# EAGLE design FioSaber Prototype (EAGLE 6.5.0)
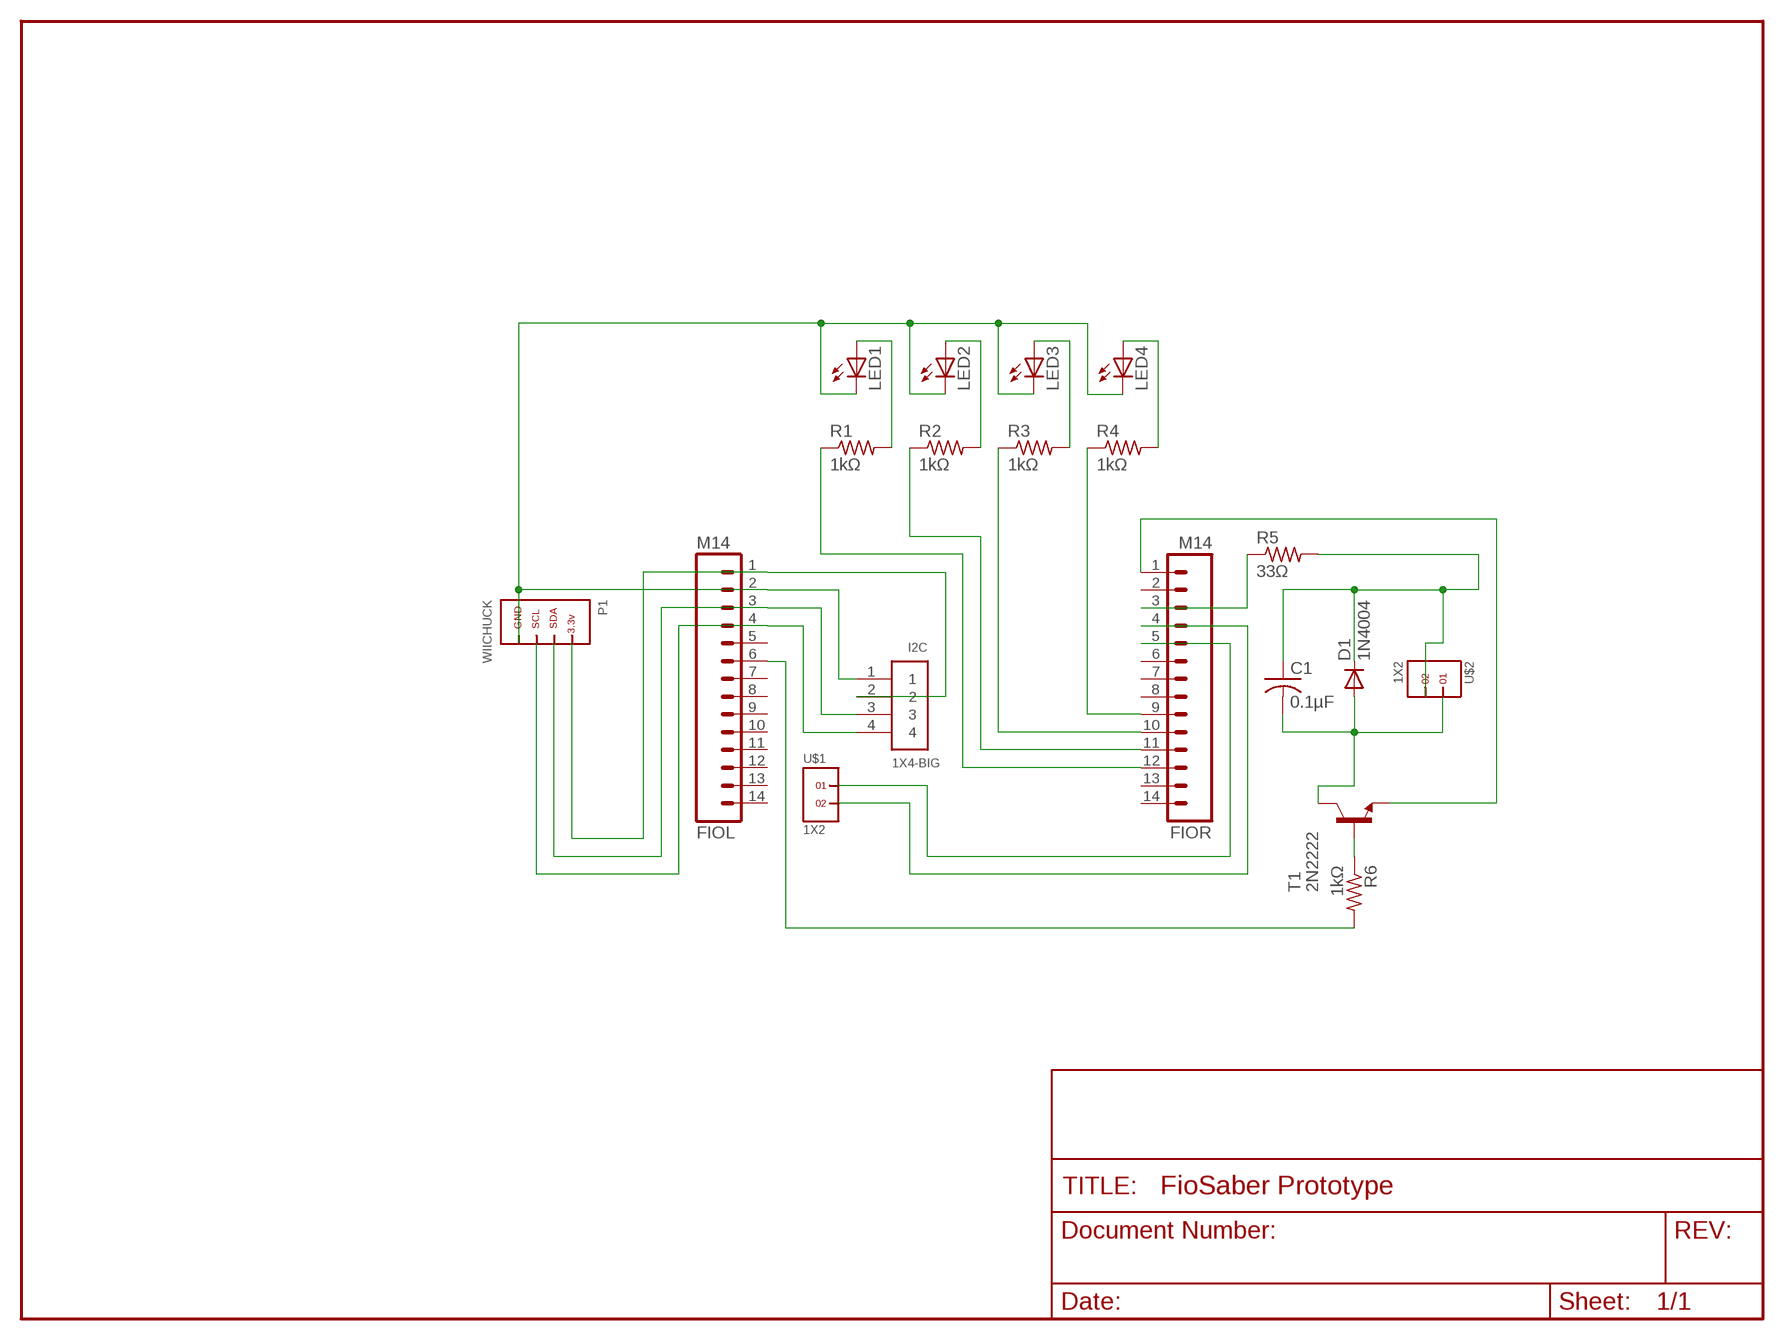
[diagram p0: schematic, sheet 1]

## Parts
C1  0.1µF  C-US025-025X050  [C025-025X050]
D1  1N4004  [DO41-10]
FIOL  M14  [1X14]
FIOR  M14  [1X14]
I2C  1X4-BIG  [1X04-BIG]
LED1  LED3MM  [LED3MM]
LED2  LED3MM  [LED3MM]
LED3  LED3MM  [LED3MM]
LED4  LED3MM  [LED3MM]
P1  WIICHUCK  [MEMOREX_RECEIVER]
R1  1kΩ  R-US_0207/10  [0207/10]
R2  1kΩ  R-US_0207/10  [0207/10]
R3  1kΩ  R-US_0207/10  [0207/10]
R4  1kΩ  R-US_0207/10  [0207/10]
R5  33Ω  R-US_0207/10  [0207/10]
R6  1kΩ  R-US_0207/10  [0207/10]
T1  2N2222  [TO92-EBC-OVAL]
U$1  1X2  [1X2]
U$2  1X2  [1X2]

## Nets
N$1: FIOL.1 I2C.2 P1.PWR
N$2: FIOR.3 R5.1
N$3: FIOL.3 I2C.3 P1.SDA
N$4: FIOL.4 I2C.4 P1.SCL
N$5: FIOR.12 R1.1
N$6: FIOR.11 R2.1
N$7: FIOR.10 R3.1
N$8: FIOR.9 R4.1
N$9: LED1.A R1.2
N$10: LED2.A R2.2
N$11: LED3.A R3.2
N$12: LED4.A R4.2
N$13: FIOL.2 I2C.1 LED1.K(C) LED2.K(C) LED3.K(C) LED4.K(C) P1.GND
N$14: FIOR.4 U$1.2
N$15: FIOR.5 U$1.1
N$16: FIOL.6 R6.2
N$17: FIOR.1 T1.E
N$18: R6.1 T1.B
N$19: C1.2 D1.A T1.C U$2.1
N$20: C1.1 D1.C R5.2 U$2.2
Unconnected: FIOL.5 FIOL.7 FIOL.8 FIOL.9 FIOL.10 FIOL.11 FIOL.12 FIOL.13 FIOL.14 FIOR.2 FIOR.6 FIOR.7 FIOR.8 FIOR.13 FIOR.14

## Library data of the parts
C1 = rcl:C-US: CAPACITOR, American symbol
D1 = adafruit:1N4004: DIODE General purpose 1N400x type rectifier (With bigger pads) http://www.ladyada.net/library/pcb/eaglelibrary.html
FIOL FIOR = SparkFun:M14: Header 14 Standard 14-pin 0.1" header. Use with straight break away headers (SKU : PRT-00116), right angle break away headers (PRT-00553), swiss pins (PRT-00743), machine pins (PRT-00117), and female headers (PRT-00115).
I2C = adafruit:1X4: 4-pin connector
LED1-LED4 = adafruit:LED: LED OSRAM: - CHIPLED LG R971, LG N971, LY N971, LG Q971, LY Q971, LO R971, LY R971 LH N974, LH R974 LS Q976, LO Q976, LY Q976 LO Q996 - Hyper CHIPLED LW Q18S LB Q993, LB Q99A, LB R99A - SideLED LS A670, LO A670, LY A670, LG A670, LP A670 LB A673, LV A673, LT A673, LW A673 LH A674 LY A675 LS A676, LA A676, LO A676, LY A676, LW A676 LS A679, LY A679, LG A679 - Hyper Micro SIDELED® LS Y876, LA Y876, LO Y876, LY Y876 LT Y87S - SmartLED LW L88C, LW L88S LB L89C, LB L89S, LG L890 LS L89K, LO L89K, LY L89K LS L896, LA L896, LO L896, LY L896 - TOPLED LS T670, LO T670, LY T670, LG T670, LP T670 LSG T670, LSP T670, LSY T670, LOP T670, LYG T670 LG T671, LOG T671, LSG T671 LB T673, LV T673, LT T673, LW T673 LH T674 LS T676, LA T676, LO T676, LY T676, LB T676, LH T676, LSB T676, LW T676 LB T67C, LV T67C, LT T67C, LS T67K, LO T67K, LY T67K, LW E67C LS E67B, LA E67B, LO E67B, LY E67B, LB E67C, LV E67C, LT E67C LW T67C LS T679, LY T679, LG T679 LS T770, LO T770, LY T770, LG T770, LP T770 LB T773, LV T773, LT T773, LW T773 LH T774 LS E675, LA E675, LY E675, LS T675 LS T776, LA T776, LO T776, LY T776, LB T776 LHGB T686 LT T68C, LB T68C - Hyper Mini TOPLED® LB M676 - Mini TOPLED Santana® LG M470 LS M47K, LO M47K, LY M47K Source: http://www.osram.convergy.de/
P1 = nintendo:WIICHUCK
R1-R6 = adafruit:R-US_: RESISTOR, American symbol
T1 = adafruit:2N2222: NPN TRANSISTOR Big oval pads
U$1 U$2 = headers(.1in):1X2

## Net classes
0 Default: width 0.203 mm, clearance 0.205 mm
2 LEDPower: width 0.203 mm
3 ButtonSignal: width 0.203 mm

## Board
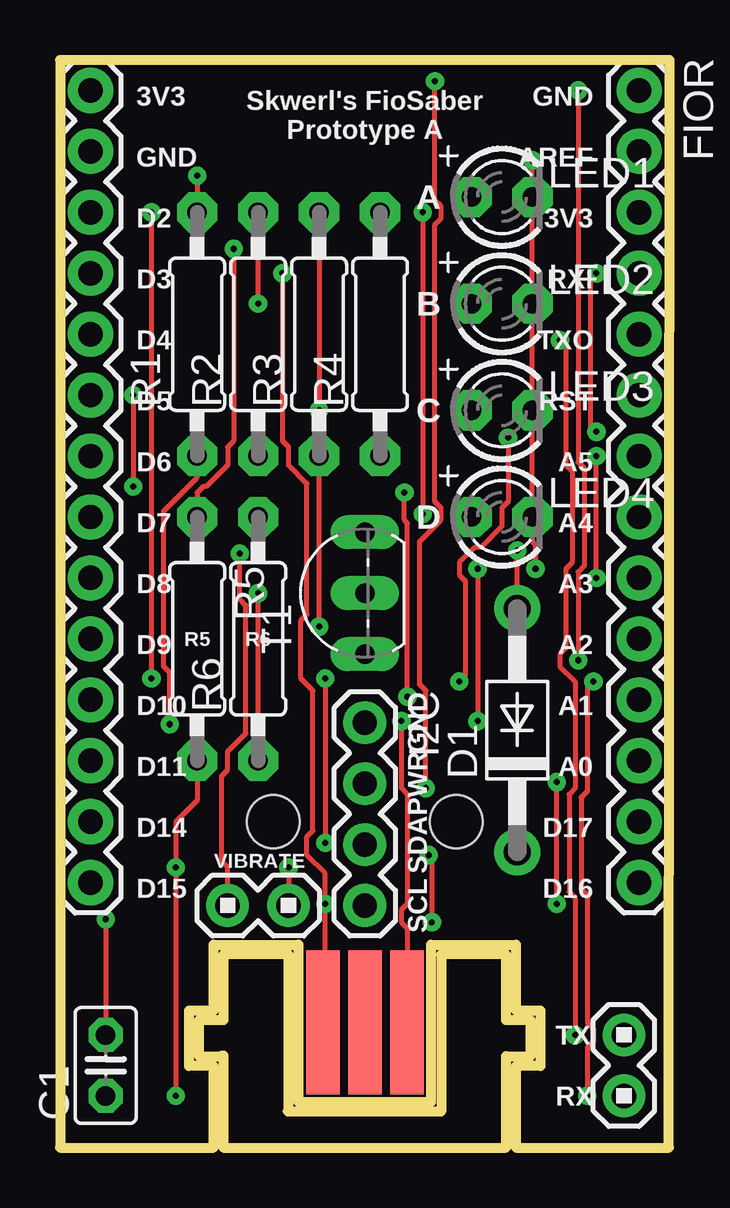
[diagram p1: board, top side]
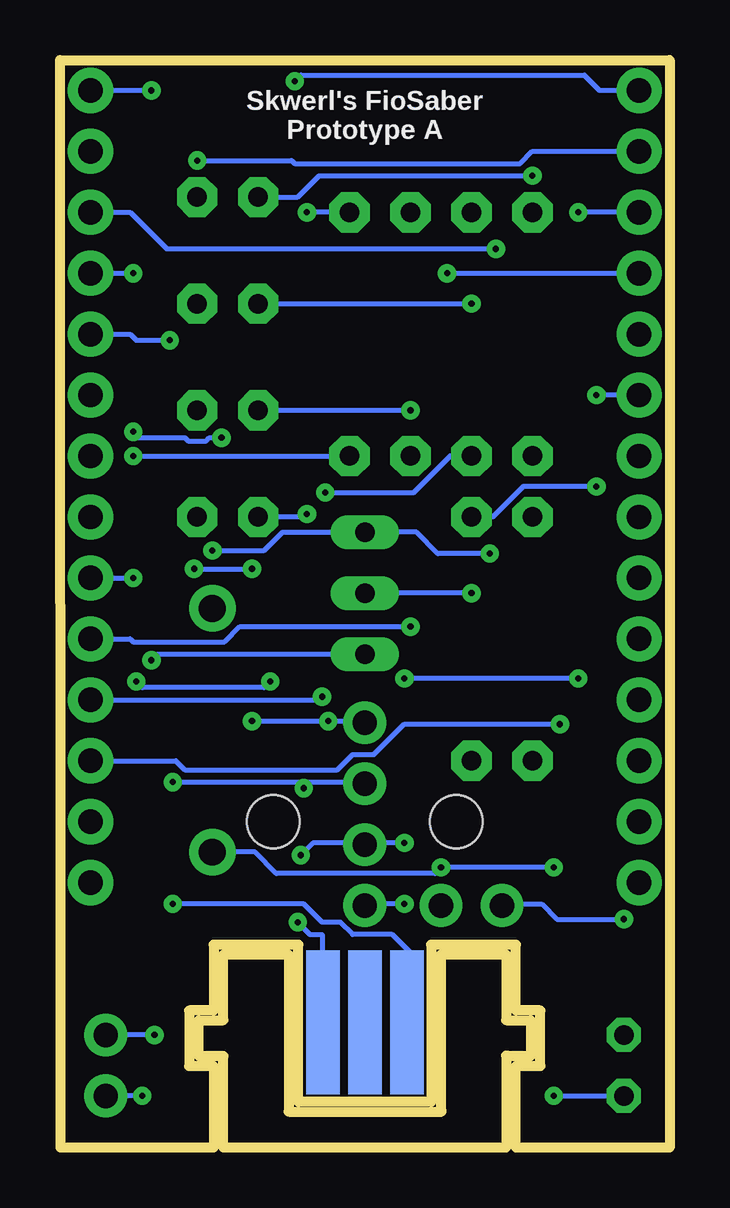
[diagram p2: board, bottom side, seen from below]

Size 25.4 x 45.34 mm. Coordinates in mm from the lower left corner, seen from the top.
Outline: 0,0 6.4,0 6.4,3.4 5.38,3.4 5.38,5.71 6.4,5.71 6.4,8.46 9.93,8.46 9.93,1.91 15.47,1.91 15.47,8.46 19,8.46 19,5.71 20.02,5.71 20.02,3.4 19,3.4 19,0 25.38,0 25.4,45.34 0,45.34 0,0
Copper layers (1*16): Top 0.035mm / dielectric 1.5mm / Bottom 0.035mm
Design rules "SparkFun *": minimum track width 8mil, minimum drill 10mil, track to track 7mil, track to pad 7mil, pad to pad 7mil, via to via 7mil, smd to smd 7mil, copper to edge 10mil, drill to drill 8mil, minimum pad ring 12mil, minimum via ring 10mil, stop-mask expansion 4mil, vias tented up to drill 20mil, thermal gap 10mil
Holes 2.2 mm at 8.89,13.59 16.51,13.59
Milling: area 5.8,0 to 19.6,8.1

### Footprints (pad centres in the part's own frame; a part is rotated, then mirrored left to right if it is on the bottom)
C025-025X050 = drill 0.813 octagon: 1 -1.27,0; 2 1.27,0
DO41-10 = drill 1.118 pad 1.93: A 5.08,0; C -5.08,0
1X14 = drill 1.016 pad 1.88: 1 0,0; 2 2.54,0; 3 5.08,0; 4 7.62,0; 5 10.16,0; 6 12.7,0; 7 15.24,0; 8 17.78,0; 9 20.32,0; 10 22.86,0; 11 25.4,0; 12 27.94,0; 13 30.48,0; 14 33.02,0
1X04-BIG = drill 1.016 pad 1.778: 1 0,0; 2 2.54,0; 3 5.08,0; 4 7.62,0
LED3MM = drill 0.813 pad 1.676 octagon: A -1.27,0; K 1.27,0
MEMOREX_RECEIVER = smd 1.4 x 6 bottom: ATT 0,5.6; PWR -1.75,5.6; SDA 1.75,5.6 | smd 1.4 x 6: GND 1.75,5.6; NC 0,5.6; SCL -1.75,5.6
0207/10 = drill 0.813 pad 1.676 octagon: 1 -5.08,0; 2 5.08,0
TO92-EBC-OVAL = drill 0.813 long: B 0,-1.27; C 2.54,-1.27; E -2.54,-1.27
1X2 = drill 1.016 pad 1.778: 1 0,0; 2 2.54,0

### Placement (x,y rotation side)
C1  1.91,3.43 90 top
D1  19.05,17.4 90 top
FIOL  1.27,44.07 270 top
FIOR  24.13,44.07 270 top
I2C  12.7,17.72 270 top
LED1  18.41,39.62 0 top
LED2  18.41,35.18 0 top
LED3  18.41,30.73 0 top
LED4  18.41,26.29 0 top
P1  12.7,-0.38 0 top
R1  5.71,33.91 90 top
R2  8.26,33.91 90 top
R3  10.79,33.91 90 top
R4  13.34,33.91 90 top
R5  5.71,21.21 270 top
R6  8.26,21.21 90 top
T1  11.43,23.11 90 top
U$1  23.5,4.7 270 top
U$2  6.99,10.1 0 top

### Tracks (layer width: path | path; a pad name or v marks a point on that pad's centre or on a via)
N$1  (via drill 0.25)
  Top 0.203: v20.7,10.16 v20.7,15.24 | v15.62,44.45 15.62,39.5 15.88,39.24 15.88,38.73 15.62,38.48 15.62,26.92 15.88,26.67 15.88,26.16 14.99,25.27 14.99,19.3 15.24,19.05 v15.24,14.99
  Bottom 0.203: v20.7,15.24 15.24,15.24 | 15.24,15.24 12.7,15.24 I2C.2 | v20.7,10.16 15.24,10.16 14.48,9.4 13.72,9.4 13.21,8.89 11.56,8.89 10.54,7.87 10.54,6.86 10.79,6.86 10.92,6.73 10.92,5.33 P1.PWR | FIOL.1 2.92,44.07 3.56,44.7 15.37,44.7 v15.62,44.45 | 15.24,15.24 v15.24,14.99
N$2  (via drill 0.25)
  Top 0.203: R5.1 5.71,27.3 5.97,27.56 6.1,27.56 6.99,28.45 6.99,29.21 7.24,29.46 v7.24,37.46
  Bottom 0.203: v7.24,37.46 20.95,37.46 22.48,38.99 FIOR.3
N$3  (via drill 0.25)
  Top 0.203: v11.05,19.56 v11.05,12.7 | v3.81,38.99 v3.81,19.56 | v15.49,9.4 15.49,12.06 v15.37,12.19
  Bottom 0.203: v11.05,12.7 12.7,12.7 | v3.81,19.56 v11.05,19.56 | FIOL.3 v3.81,38.99 | v15.49,9.4 14.99,8.89 14.48,8.89 14.48,5.33 P1.SDA | v15.37,12.19 14.86,12.7 12.7,12.7 | 12.7,12.7 I2C.3
N$4  (via drill 0.25)
  Top 0.203: P1.SCL 10.92,5.33 10.92,6.86 11.05,6.98 v11.05,10.16 11.05,11.43 10.29,12.19 10.29,12.95 10.54,13.21 10.54,19.05 10.03,19.56 10.03,21.97 10.29,22.23 10.29,27.69 9.53,28.45 9.53,29.21 9.27,29.46 v9.27,36.45
  Bottom 0.203: v11.05,10.16 12.7,10.16 I2C.4 | v9.27,36.45 FIOL.4
N$5  (via drill 0.25)
  Top 0.203: R1.1 5.71,27.94 4.32,26.54 4.32,20.07 4.57,19.81 v4.57,17.65
  Bottom 0.203: v4.57,17.65 11.05,17.65 12.32,16.38 13.21,16.38 13.84,15.75 20.19,15.75 20.57,16.13 FIOR.12
N$6  (via drill 0.25)
  Top 0.203: v14.35,27.3 14.35,26.16 14.48,26.04 v14.48,18.8
  Bottom 0.203: R2.1 9.14,28.83 10.67,27.3 v14.35,27.3 | v14.48,18.8 14.61,18.67 FIOR.11
N$7  (via drill 0.25)
  Top 0.203: v10.79,21.72 R3.1
  Bottom 0.203: v10.79,21.72 17.91,21.72 18.54,21.08 22.35,21.08 22.48,21.21 FIOR.10
N$8  (via drill 0.25)
  Top 0.203: v22.35,23.75 v22.35,28.83
  Bottom 0.203: v22.35,28.83 R4.1 | FIOR.9 v22.35,23.75
N$9  (via drill 0.25)
  Top 0.203: v5.71,40.51 R1.2
  Bottom 0.203: v5.71,40.51 14.61,40.51 15.49,39.62 LED1.A
N$10  (via drill 0.25)
  Top 0.203: v8.26,35.18 R2.2
  Bottom 0.203: LED2.A v8.26,35.18
N$11  (via drill 0.25)
  Top 0.203: R3.2 v10.79,30.73
  Bottom 0.203: v10.79,30.73 LED3.A
N$12  (via drill 0.25)
  Top 0.203: v15.11,38.99 v15.11,26.42
  Bottom 0.203: LED4.A 15.24,26.29 v15.11,26.42 | R4.2 v15.11,38.99
N$13  (via drill 0.25)
  Top 0.203: v17.4,24.13 v17.4,17.78 | v19.81,24.13 19.81,25.15 19.68,25.27 LED4.K LED3.K LED2.K LED1.K v19.68,41.15 | v14.22,17.78 14.22,14.99 14.48,14.73 14.48,10.16 14.22,9.91 14.22,9.4 14.48,9.14 14.48,5.33 P1.GND
  Bottom 0.203: v17.4,17.78 v14.22,17.78 12.7,17.78 I2C.1 | v19.81,24.13 v17.4,24.13 | FIOL.2 5.71,41.53 6.22,41.02 15.62,41.02 15.75,41.15 v19.68,41.15
N$14  (via drill 0.25)
  Top 0.203: v21.97,2.16 21.97,4.19 22.23,4.44 22.23,4.95 21.97,5.21 21.97,10.54 21.72,10.79 21.72,14.61 21.97,14.86 21.97,19.18 v22.23,19.43 | v16.64,19.43 16.89,19.68 16.89,23.62 16.64,23.88 16.64,24.38 17.27,25.02 17.53,25.02 18.41,25.91 18.41,26.67 18.67,26.92 v18.67,29.59 | v22.35,29.84 22.1,30.1 22.1,36.2 v22.35,36.45
  Bottom 0.203: v21.97,2.16 U$1.2 | v22.23,19.43 21.97,19.18 16.89,19.18 v16.64,19.43 | v18.67,29.59 19.18,29.59 19.3,29.46 20.07,29.46 20.19,29.59 22.1,29.59 v22.35,29.84 | FIOR.4 v22.35,36.45
N$15  (via drill 0.25)
  Top 0.203: v21.46,4.7 21.46,10.41 21.21,10.67 21.21,14.73 21.46,14.99 21.46,19.43 20.83,20.07 20.83,20.57 21.08,20.83 21.08,24.13 21.34,24.38 21.34,28.19 21.08,28.45 21.08,33.4 v20.83,33.66
  Bottom 0.203: v21.46,4.7 U$1.1 | v20.83,33.66 22.23,33.66 22.48,33.91 FIOR.5
N$16  (via drill 0.25)
  Top 0.203: v3.05,31.37 v3.05,27.56
  Bottom 0.203: R6.2 7.37,26.29 6.1,27.56 v3.05,27.56 | FIOL.6 v3.05,31.37
N$17  (via drill 0.25)
  Top 0.203: v21.59,20.32 21.59,24 21.84,24.26 21.84,28.32 21.59,28.57 v21.59,44.07
  Bottom 0.203: T1.E 21.34,20.57 v21.59,20.32 | FIOR.1 v21.59,44.07
N$18  (via drill 0.25)
  Top 0.203: R6.1 v8.26,23.11
  Bottom 0.203: v8.26,23.11 T1.B
N$19  (via drill 0.25)
  Top 0.203: D1.A v19.05,24.89 | v1.91,9.53 C1.2 | v7.49,24.77 7.49,22.86 7.75,22.61 7.75,17.27 6.99,16.51 6.99,15.75 6.73,15.49 6.73,11.94 6.99,11.68 U$2.1
  Bottom 0.203: v19.05,24.89 16.89,24.89 16.13,25.65 T1.C 10.54,25.65 9.65,24.77 v7.49,24.77 | v1.91,9.53 4.7,9.53 5.33,10.16 6.99,10.16 U$2.1
N$20  (via drill 0.25)
  Top 0.203: v4.83,2.16 v4.83,11.68 4.83,13.59 5.71,14.48 R5.2 | v9.53,11.68 U$2.2
  Bottom 0.203: v4.83,2.16 C1.1 | v4.83,11.68 v9.53,11.68 9.78,11.43 16.38,11.43 17.27,12.32 D1.C

### Text on the board
tPlace: 3V3 | Skwerl's FioSaber / Prototype A | GND | GND | AREF | A | D2 | 3V3 | D3 | B | RXI | D4 | TXO | D5 | C | RST | D6 | A5 | D | D7 | A4 | D8 | A3 | R5 | R6 | D9 | A2 | D10 | GND | A1 | D11 | PWR | A0 | D14 | SDA | D17 | VIBRATE | D15 | D16 | SCL | TX | RX
bPlace: Skwerl's FioSaber / Prototype A